# EAGLE design display-controller (EAGLE 6.5.0)
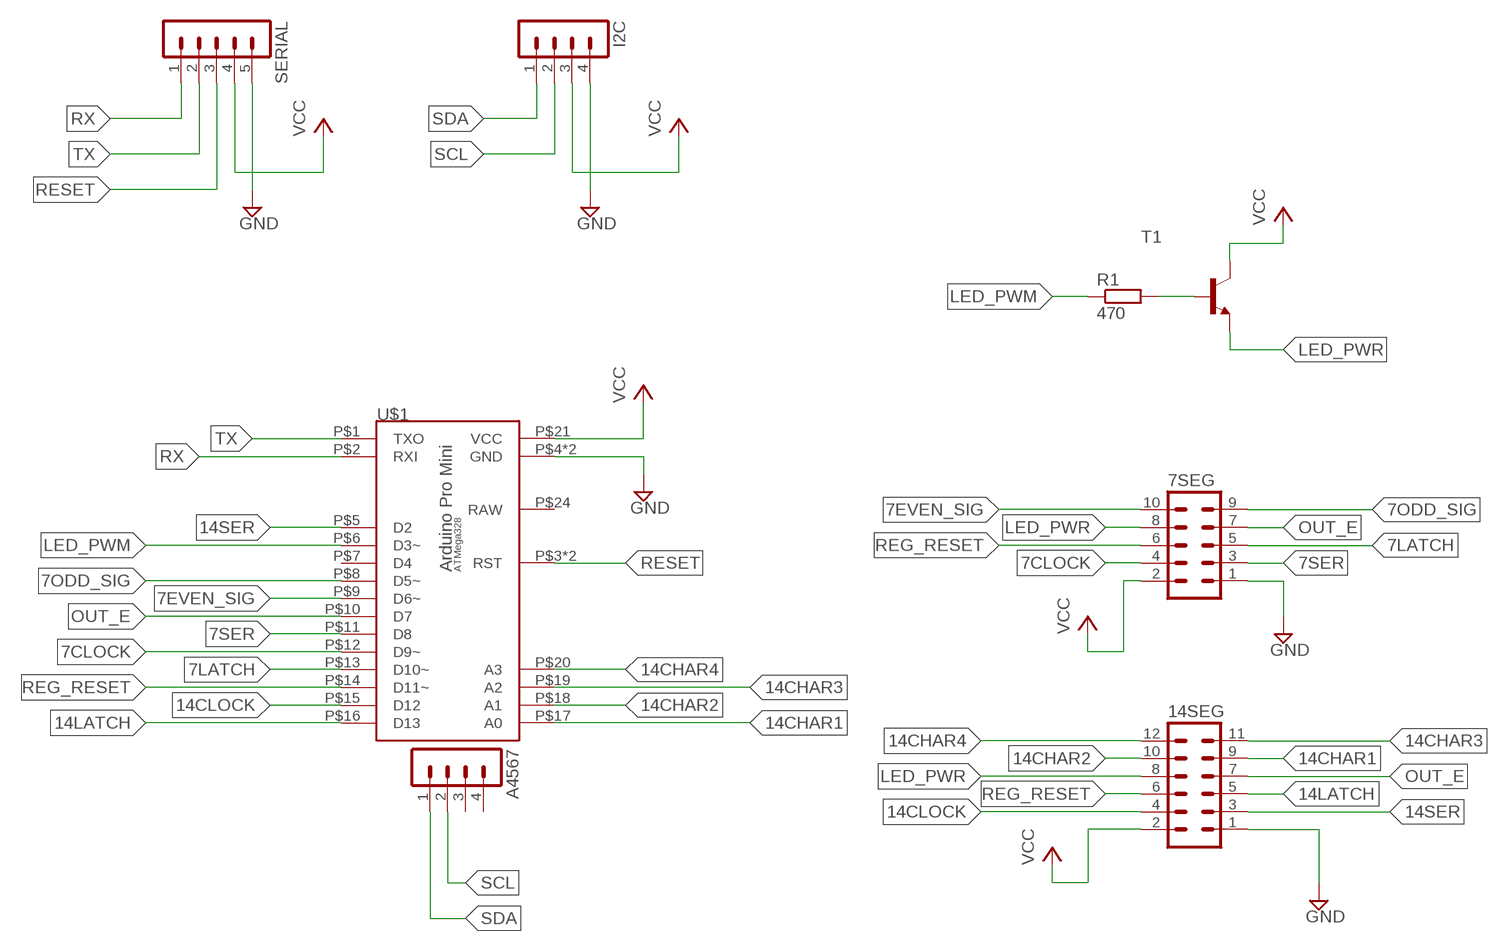
[diagram p0: schematic, sheet 1]

## Parts
7SEG  MA05-2  [MA05-2]
14SEG  MA06-2  [MA06-2]
A4567  MA04-1  [MA04-1]
I2C  MA04-1  [MA04-1]
R1  470  R-EU_0207/2V  [0207/2V]
SERIAL  MA05-1  [MA05-1]
T1  BC337-40-NPN-TO92-CBE  [TO92-CBE]
U$1  ARDUINO-PRO-MINI-BARE  [DIP24W]

## Nets
7CLOCK: 7SEG.4 U$1.P$12(D9~)
7EVEN_SIG: 7SEG.10 U$1.P$9(D6~)
7LATCH: 7SEG.5 U$1.P$13(D10~)
7ODD_SIG: 7SEG.9 U$1.P$8(D5~)
7SER: 7SEG.3 U$1.P$11(D8)
14CHAR1: 14SEG.9 U$1.P$17(A0)
14CHAR2: 14SEG.10 U$1.P$18(A1)
14CHAR3: 14SEG.11 U$1.P$19(A2)
14CHAR4: 14SEG.12 U$1.P$20(A3)
14CLOCK: 14SEG.4 U$1.P$15(D12)
14LATCH: 14SEG.5 U$1.P$16(D13)
14SER: 14SEG.3 U$1.P$5(D2)
GND: 7SEG.1 14SEG.1 I2C.4 SERIAL.5 U$1.P$4(GND) U$1.P$23(GND)
LED_PWM: R1.1 U$1.P$6(D3~)
LED_PWR: 7SEG.8 14SEG.8 T1.E
N$1: R1.2 T1.B
OUT_E: 7SEG.7 14SEG.7 U$1.P$10(D7)
REG_RESET: 7SEG.6 14SEG.6 U$1.P$14(D11~)
RESET: SERIAL.3 U$1.P$3(RST) U$1.P$22(RST)
RX: SERIAL.1 U$1.P$2(RXI)
SCL: A4567.2 I2C.2
SDA: A4567.1 I2C.1
TX: SERIAL.2 U$1.P$1(TXO)
VCC: 7SEG.2 14SEG.2 I2C.3 SERIAL.4 T1.C U$1.P$21(VCC)
Unconnected: A4567.3 A4567.4 U$1.P$7(D4) U$1.P$24(RAW)

## Library data of the parts
7SEG = con-lstb:MA05-2: PIN HEADER; OC_FARNELL: unknown; OC_NEWARK: unknown
14SEG = con-lstb:MA06-2: PIN HEADER; OC_FARNELL: unknown; OC_NEWARK: unknown
A4567 I2C = con-lstb:MA04-1: PIN HEADER; OC_FARNELL: unknown; OC_NEWARK: unknown
R1 = rcl:R-EU_: RESISTOR, European symbol
SERIAL = con-lstb:MA05-1: PIN HEADER; OC_FARNELL: unknown; OC_NEWARK: unknown
T1 = transistor:*-NPN-: NPN Transistror BF959 corrected 2008.03.06
U$1 = arduino-pro-mini:ARDUINO-PRO-MINI-BARE

## Board
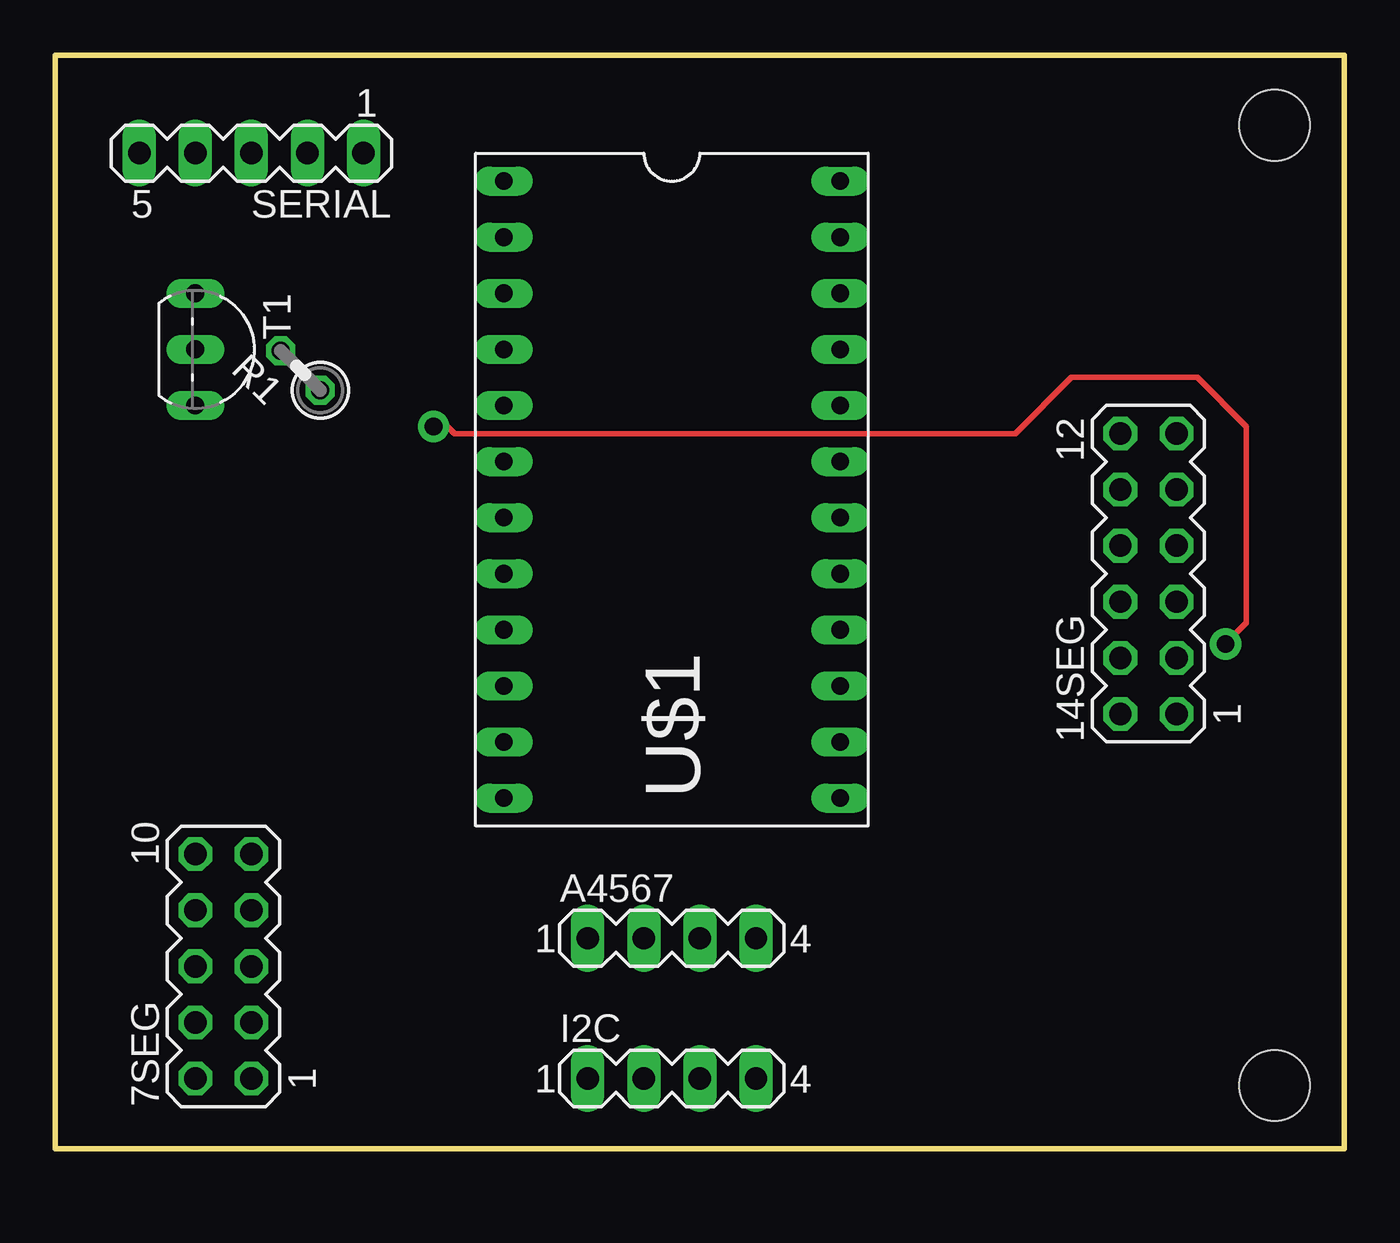
[diagram p1: board, top side]
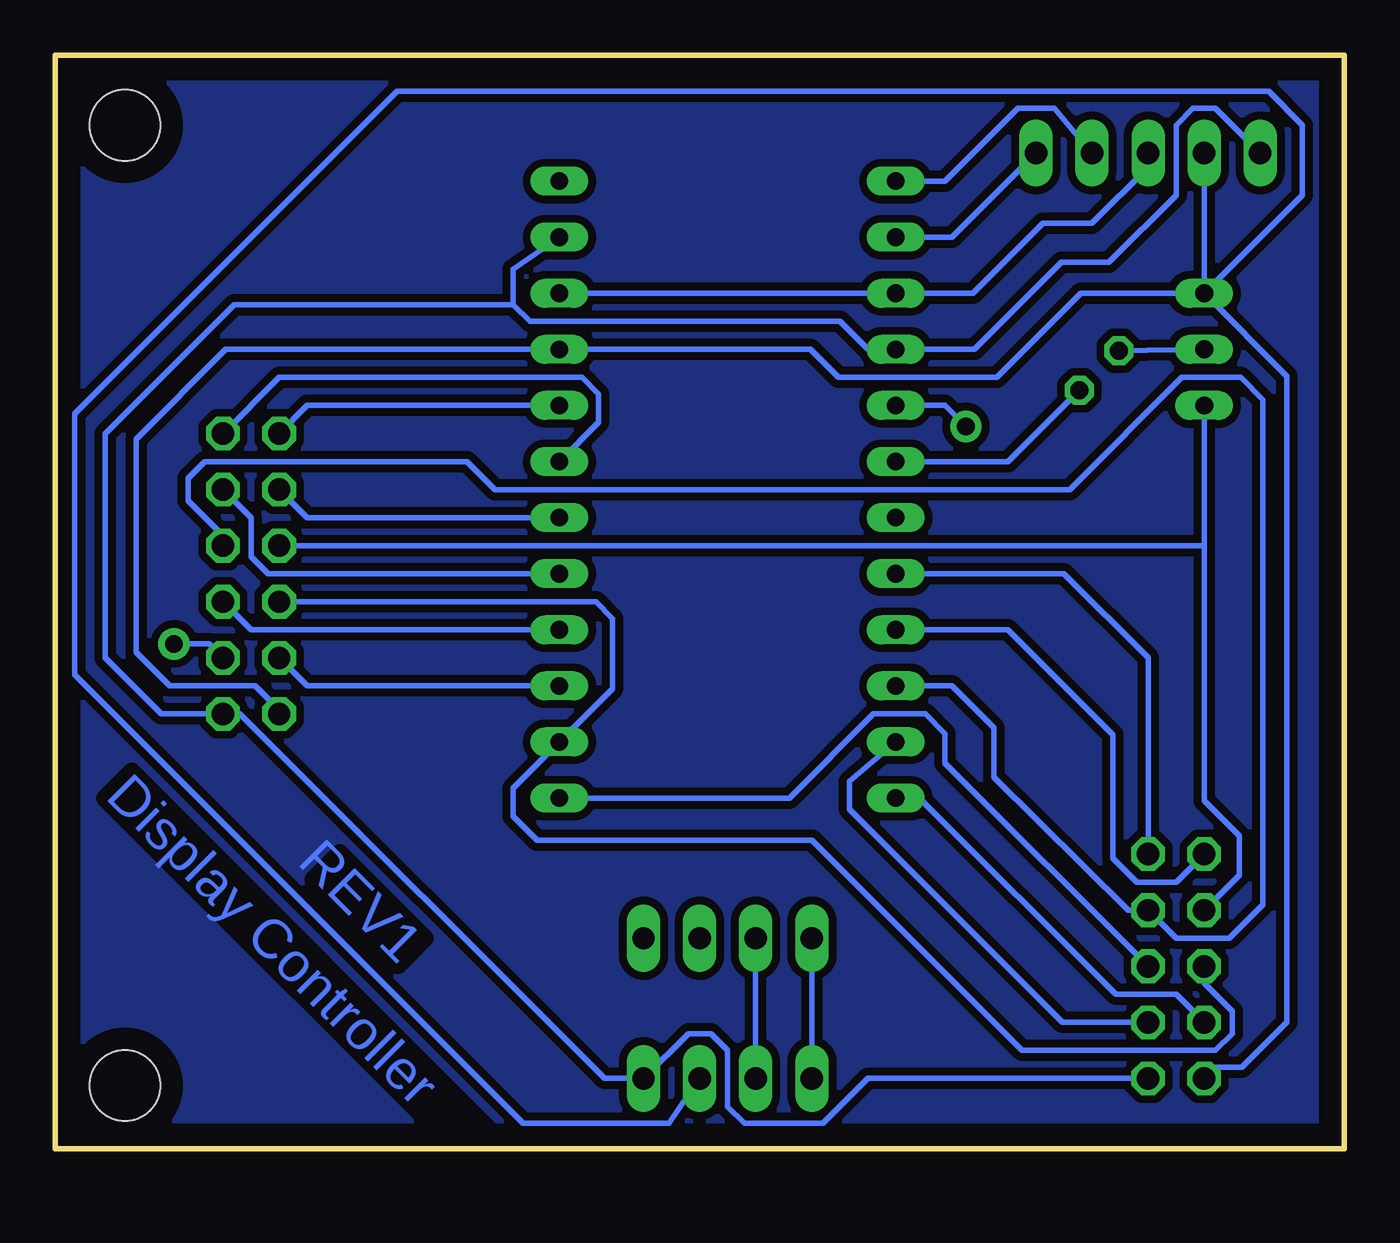
[diagram p2: board, bottom side, seen from below]

Size 58.41 x 49.52 mm. Coordinates in mm from the lower left corner, seen from the top.
Outline: 0,0 58.41,0 58.41,49.52 0,49.52 0,0
Copper layers (1*16): Top 0.035mm / dielectric 1.5mm / Bottom 0.035mm
Design rules "default *": minimum track width 10mil, minimum drill 24mil, track to track 14mil, track to pad 14mil, pad to pad 14mil, via to via 14mil, smd to smd 8mil, copper to edge 40mil, drill to drill 8mil, minimum pad ring 10mil, minimum via ring 8mil, stop-mask expansion 4mil, vias tented up to drill 0mil, thermal gap 10mil
Holes 3.2 mm at 55.24,46.36 55.24,2.86

### Footprints (pad centres in the part's own frame; a part is rotated, then mirrored left to right if it is on the bottom)
MA05-2 = drill 1.016 octagon: 1 -5.08,-1.27; 2 -5.08,1.27; 3 -2.54,-1.27; 4 -2.54,1.27; 5 0,-1.27; 6 0,1.27; 7 2.54,-1.27; 8 2.54,1.27; 9 5.08,-1.27; 10 5.08,1.27
MA06-2 = drill 1.016 octagon: 1 -6.35,-1.27; 2 -6.35,1.27; 3 -3.81,-1.27; 4 -3.81,1.27; 5 -1.27,-1.27; 6 -1.27,1.27; 7 1.27,-1.27; 8 1.27,1.27; 9 3.81,-1.27; 10 3.81,1.27; 11 6.35,-1.27; 12 6.35,1.27
MA04-1 = drill 1.016 long: 1 -3.81,0; 2 -1.27,0; 3 1.27,0; 4 3.81,0
0207/2V = drill 0.813 octagon: 1 -1.27,0; 2 1.27,0
MA05-1 = drill 1.016 long: 1 -5.08,0; 2 -2.54,0; 3 0,0; 4 2.54,0; 5 5.08,0
TO92-CBE = drill 0.813 long: B 0,0; C -2.54,0; E 2.54,0
DIP24W = drill 0.8 pad 1.27 long: P$1 -7.62,13.97; P$2 -7.62,11.43; P$3 -7.62,8.89; P$4 -7.62,6.35; P$5 -7.62,3.81; P$6 -7.62,1.27; P$7 -7.62,-1.27; P$8 -7.62,-3.81; P$9 -7.62,-6.35; P$10 -7.62,-8.89; P$11 -7.62,-11.43; P$12 -7.62,-13.97; P$13 7.62,-13.97; P$14 7.62,-11.43; P$15 7.62,-8.89; P$16 7.62,-6.35; P$17 7.62,-3.81; P$18 7.62,-1.27; P$19 7.62,1.27; P$20 7.62,3.81; P$21 7.62,6.35; P$22 7.62,8.89; P$23 7.62,11.43; P$24 7.62,13.97

### Placement (x,y rotation side)
7SEG  7.62,8.26 90 top
14SEG  49.53,26.04 90 top
A4567  27.94,9.53 0 top
I2C  27.94,3.17 0 top
R1  11.11,35.24 135 top
SERIAL  8.89,45.09 180 top
T1  6.35,36.2 270 top
U$1  27.94,29.84 0 top

### Tracks (layer width: path | path; a pad name or v marks a point on that pad's centre or on a via)
7CLOCK
  Bottom 0.254: U$1.P$12 19.24,15.88 10.35,6.99 7.62,6.99 7SEG.4
7EVEN_SIG
  Bottom 0.254: U$1.P$9 15.24,23.49 10.48,18.73 10.48,13.14 9.4,12.06 7.62,12.06 7SEG.10
7LATCH
  Bottom 0.254: U$1.P$13 25.15,15.88 21.34,19.68 18.99,19.68 18.1,18.8 18.1,17.46 7SEG.5
7ODD_SIG
  Bottom 0.254: U$1.P$8 12.7,26.04 8.89,22.22 7SEG.9
7SER
  Bottom 0.254: U$1.P$11 22.42,16.64 22.42,15.37 12.76,5.71 7SEG.3
14CHAR1
  Bottom 0.254: U$1.P$17 48.77,26.04 49.53,26.8 49.53,28.57 14SEG.9
14CHAR2
  Bottom 0.254: U$1.P$18 46.99,28.57 14SEG.10
14CHAR3
  Bottom 0.254: U$1.P$19 33.78,32.89 33.78,34.16 34.54,34.93 48.26,34.93 14SEG.11
14CHAR4
  Bottom 0.254: U$1.P$20 46.99,33.66 14SEG.12
14CLOCK
  Bottom 0.254: U$1.P$15 46.99,20.95 14SEG.4
14LATCH
  Bottom 0.254: U$1.P$16 49.53,23.49 14SEG.5
14SER  (via drill 0.8 pad 1.42)
  Top 0.254: v17.14,32.7 17.78,32.7 18.1,32.39 43.5,32.39 46.04,34.93 51.75,34.93 53.98,32.7 53.98,23.81 v53.02,22.86
  Bottom 0.254: U$1.P$5 18.1,33.66 v17.14,32.7 | v53.02,22.86 51.44,22.86 14SEG.3
GND
  Bottom 0.254: 37.66,38.23 36.89,37.47 22.86,37.47 21.59,36.2 U$1.P$4 16.76,36.2 12.83,40.13 10.67,40.13 7.62,43.18 7.62,46.36 6.86,47.12 5.84,47.12 SERIAL.5 | 37.66,38.23 37.66,39.82 U$1.P$23 | 7SEG.1 21.59,3.17 23.62,1.14 27.18,1.14 27.94,1.91 27.94,4.45 28.7,5.21 29.72,5.21 I2C.4 33.53,3.17 50.04,19.68 14SEG.1 53.59,19.68 56.13,22.22 56.13,32.39 50.29,38.23 37.66,38.23
LED_PWM
  Bottom 0.254: U$1.P$6 15.24,31.11 R1.1
LED_PWR
  Bottom 0.254: 6.35,27.3 6.35,15.75 4.76,14.16 4.76,12.38 7SEG.8 | 6.35,27.3 T1.E | 6.35,27.3 14SEG.8
N$1
  Bottom 0.254: R1.2 T1.B
N$2
  pour Bottom: 0,50.16 59.37,50.16 59.05,-0.95 -0.32,-0.95
OUT_E
  Bottom 0.254: U$1.P$10 17.78,20.95 15.88,19.05 15.88,16.83 9.78,10.79 7SEG.7 7.62,9.53 5.21,9.53 3.68,11.05 3.68,33.91 4.7,34.93 7.37,34.93 12.45,29.84 38.48,29.84 39.75,31.11 51.63,31.11 52.39,30.35 52.39,29.34 50.8,27.75 14SEG.7
REG_RESET
  Bottom 0.254: 14SEG.6 33.91,24.76 33.15,24 33.15,20.83 U$1.P$14 37.66,16.32 37.66,15.05 36.58,13.97 24.13,13.97 14.61,4.45 5.84,4.45 5.08,5.21 5.08,6.22 6.35,7.49 7SEG.6
RESET
  Bottom 0.254: U$1.P$22 U$1.P$3 16.83,38.73 13.65,41.91 11.43,41.91 8.89,44.45 SERIAL.3
RX
  Bottom 0.254: U$1.P$2 17.78,41.27 SERIAL.1
SCL
  Bottom 0.254: A4567.2 I2C.2
SDA
  Bottom 0.254: A4567.1 I2C.1
TX
  Bottom 0.254: U$1.P$1 18.1,43.82 14.8,47.12 13.14,47.12 SERIAL.2
VCC
  Bottom 0.254: T1.C 11.94,38.73 15.75,34.93 22.92,34.93 24.19,36.2 U$1.P$21 50.67,36.2 54.74,32.13 54.74,22.48 53.21,20.95 49.34,20.95 48.07,19.68 14SEG.2 | 7SEG.2 5.84,3.68 4.64,3.68 2.6,5.71 2.6,34.99 T1.C | I2C.3 30.61,1.14 37.21,1.14 57.53,21.46 57.53,33.27 42.93,47.88 3.43,47.88 1.91,46.36 1.91,43.18 T1.C | T1.C SERIAL.4

### Text on the board
Bottom: Display Controller | REV1